# EAGLE design ForceReset (EAGLE 7.6.0)
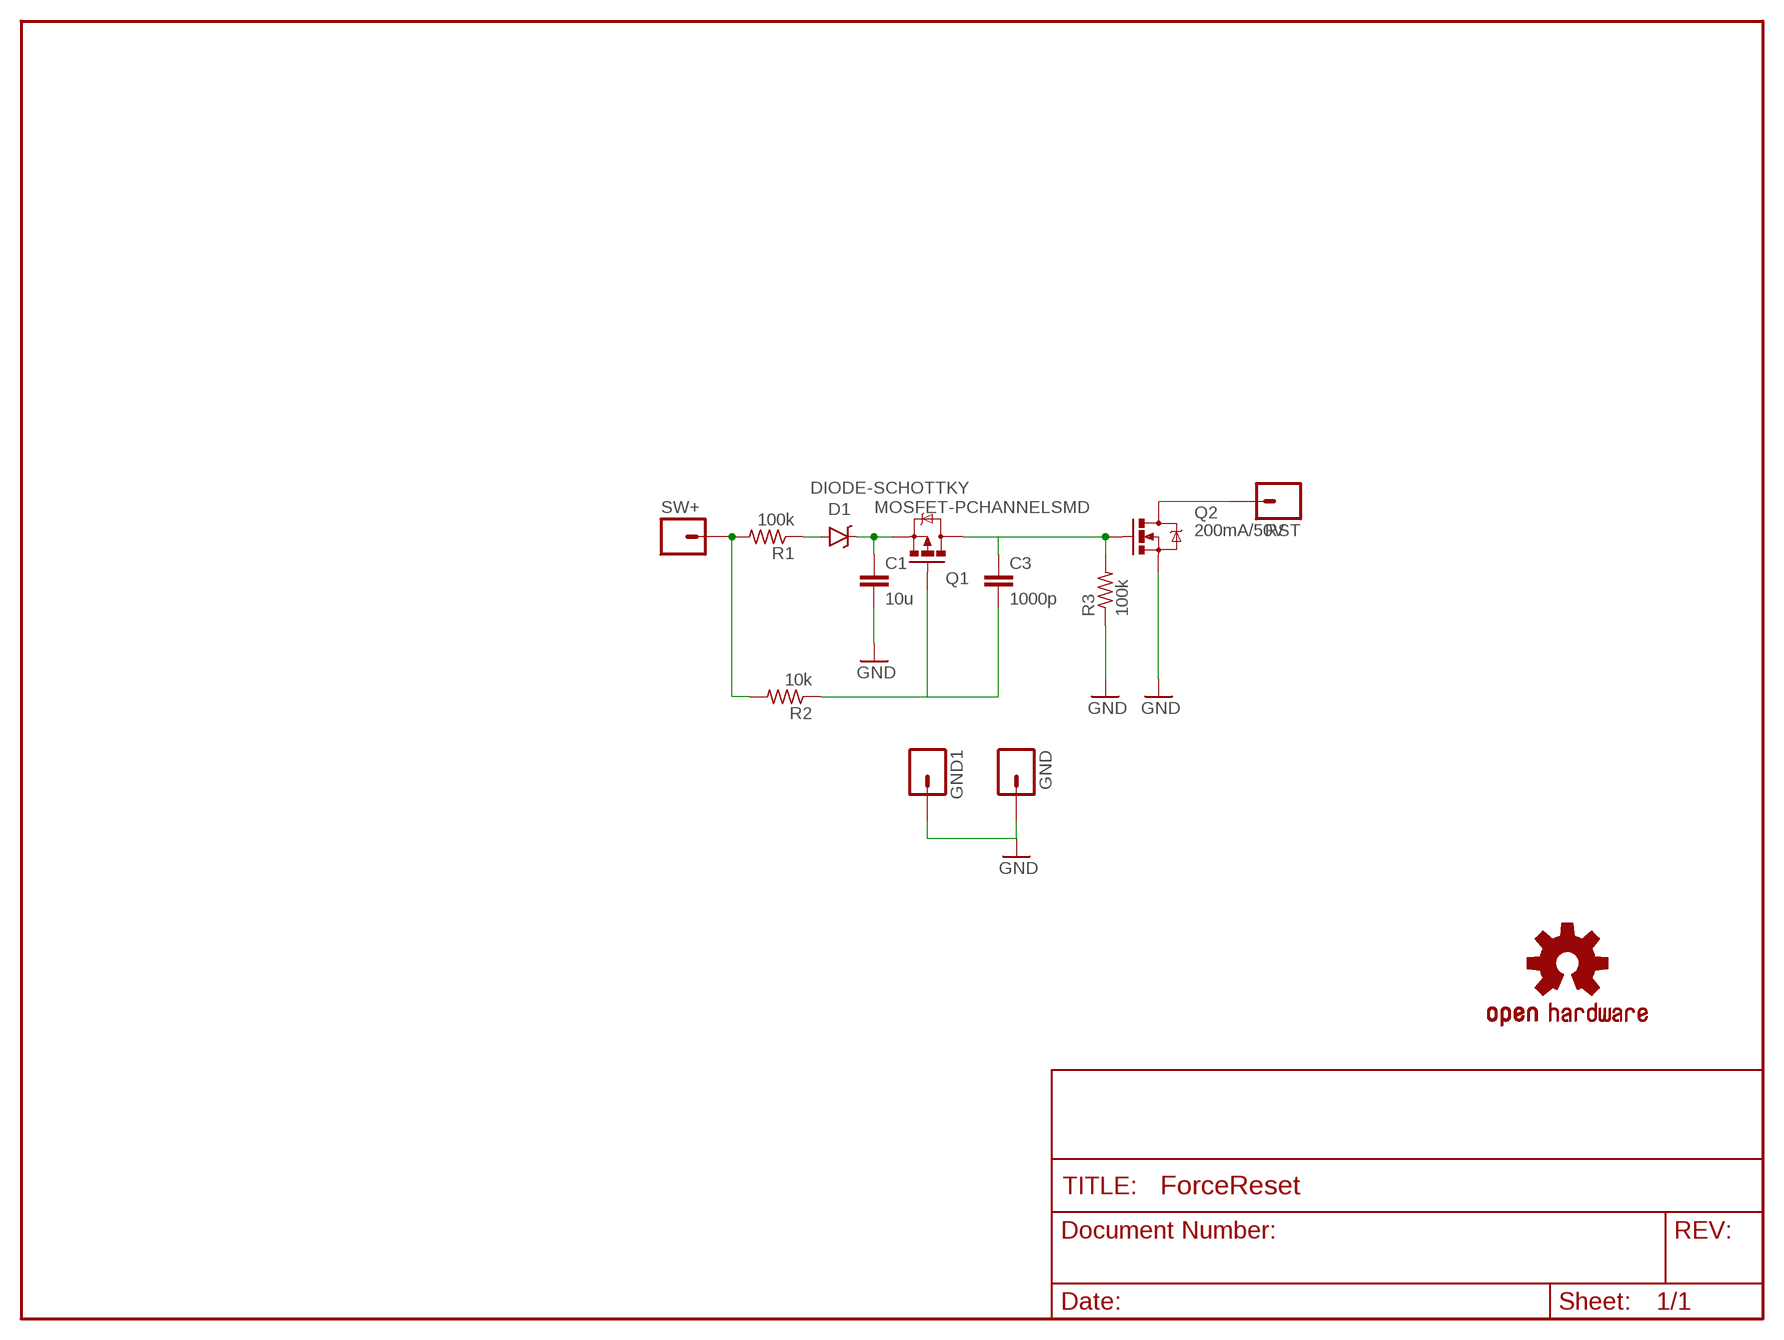
[diagram p0: schematic, sheet 1]

## Parts
C1  10u  CAP1608  [1608]
C3  1000p  CAP1608  [1608]
D1  DIODE-SCHOTTKY  [TUMD2]
GND  M01PTH  [1X01]
GND1  M01PTH  [1X01]
LOGO1  OSHW-LOGOS  [OSHW-LOGO-S]
Q1  MOSFET-PCHANNELSMD  [SOT23-3]
Q2  200mA/50V  MOSFET-NCHANNELBSS138  [SOT23-3]
R1  100k  R-US_1608  [1608]
R2  10k  R-US_1608  [1608]
R3  100k  R-US_1608  [1608]
RST  M01PTH  [1X01]
SW+  M01PTH  [1X01]

## Nets
GND: C1.P$2 GND1.1 GND.1 Q2.2(S) R3.P$1
N$1: R1.P$2 R2.P$2 SW+.1
N$2: C1.P$1 D1.C Q1.2(S)
N$3: C3.P$1 Q1.3(D) Q2.1(G) R3.P$2
N$4: Q2.3(D) RST.1
N$5: C3.P$2 Q1.1(G) R2.P$1
N$6: D1.A R1.P$1

## Library data of the parts
C1 C3 = KinyaLibrary:CAP: Capacitor Standard 0603 ceramic capacitor, and 0.1" leaded capacitor.
D1 = KinyaLibrary:DIODE-SCHOTTKY: Schottky diodes in SFE's production catalog BAT20J 1A 23V 0.62Vf RB751 120mA 40V 0.37Vf PMEG4005EJ 0.5A 40V 0.42Vf MBRA140 1A 40V 0.5Vf B340A 3A 40V SMA
GND GND1 RST SW+ = SparkFun-Connectors:M01: Header 1 Standard 1-pin 0.1" header. Use with straight break away headers (SKU : PRT-00116), right angle break away headers (PRT-00553), swiss pins (PRT-00743), machine pins (PRT-00117), and female headers (PRT-00115).
LOGO1 = SparkFun-Aesthetics:OSHW-LOGO: Open Source Hardware Logo This logo indicates the piece of hardware it is found on incorporates a OSHW license and/or adheres to the definition of open source hardware found here: http://freedomdefined.org/OSHW
Q1 = SparkFun-DiscreteSemi:MOSFET-PCHANNEL: Generic PMOSFET IRLML2244 - TRANS-11153 (SOT-23 -20V -4.3A) (1.Gate 2.Source 3.Drain) FQP27P06 - COM-10349 <http://www.sparkfun.com/products/10349> (TO-220 -60V -27A) (1.Gate 2.Source 3.Drain)
Q2 = SparkFun-DiscreteSemi:MOSFET-NCHANNEL: Common NMOSFET Parts MFG P/N Store ID Prod ID FDD8780 TRANS-09984 SI7820DN TRANS-11055 FDS6630A IC-08089 2N7002PW TRANS-11151 FQP30N06L COM-10213 TRANS-10060 BSS123LT1G TRANS-08345 BSS138 TRANS-00830 BS170 2N7000; PROD_ID: TRANS-00830
R1-R3 = KinyaLibrary:R-US_: RESISTOR, American symbol

## Board
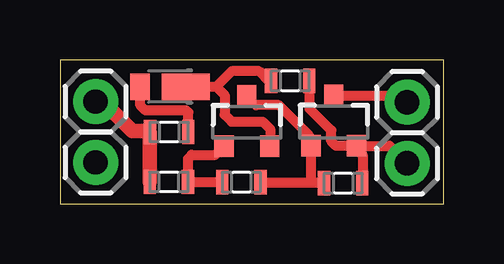
[diagram p1: board, top side]
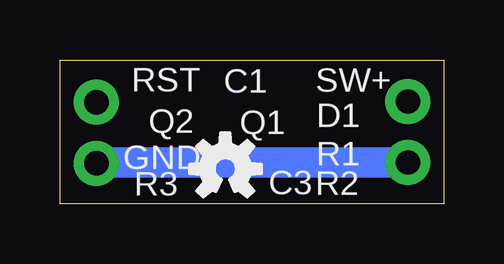
[diagram p2: board, bottom side, seen from below]

Size 15.98 x 6.02 mm. Coordinates in mm from the lower left corner, seen from the top.
Outline: 0,0 15.98,0 15.98,6.02 0,6.02 0,0
Copper layers (1*16): Top 0.035mm / dielectric 1.5mm / Bottom 0.035mm
Design rules "Elecrow_2-layer_eagle_rule": minimum track width 6mil, minimum drill 12mil, track to track 6mil, track to pad 6mil, pad to pad 6mil, via to via 6mil, smd to smd 0mil, copper to edge 10mil, drill to drill 10mil, minimum pad ring 10mil, minimum via ring 6mil, stop-mask expansion 2mil, vias tented up to drill 100mil, thermal gap 10mil

### Footprints (pad centres in the part's own frame; a part is rotated, then mirrored left to right if it is on the bottom)
1608 = smd 0.508 x 1.016: P$1 -0.8,0; P$2 0.8,0
TUMD2 = smd 0.8 x 1.1: A 1.25,0 | smd 2 x 1.1: C -0.65,0
1X01 = drill 1.016 pad 1.88: 1 0,0
SOT23-3 = smd 0.8 x 0.9: 1 -0.95,-1; 2 0.95,-1; 3 0,1.1

### Placement (x,y rotation side)
C1  9.59,5.14 0 top
C3  7.56,0.91 180 top
D1  4.58,4.9 180 top
GND  14.47,1.7 0 top
GND1  1.49,1.74 0 top
LOGO1  9.09,1.47 0 bottom
Q1  7.79,3.42 0 top
Q2  11.4,3.43 0 top
R1  4.55,3.01 180 top
R2  4.53,0.93 180 top
R3  11.8,0.88 180 top
RST  14.47,4.25 0 top
SW+  1.49,4.28 0 top

### Tracks (layer width: path | path; a pad name or v marks a point on that pad's centre or on a via)
GND
  Top 0.254: Q2.2 12.36,2.31 | 12.61,0.89 R3.P$1 | C1.P$2
  Top 0.406: 12.36,2.31 12.61,2.06 12.61,0.89 | C1.P$2 10.4,3.98 11.3,3.07 11.3,2.62 11.49,2.43 Q2.2 13.74,2.43 GND.1
  Bottom 1.27: GND1.1 14.43,1.74 GND.1
N$1
  Top 0.254: 3.7,3.06 R1.P$2 3.73,3
  Top 0.61: SW+.1 1.79,4.28 3.01,3.06 3.7,3.06 | R2.P$2 3.73,3
N$2
  Top 0.254: 8.75,2.43 Q1.2 | C1.P$1 8.7,5.14
  Top 0.406: D1.C 6.5,4.9 | 6.5,4.9 6.86,4.55 6.86,3.73 7.15,3.44 8.45,3.44 8.75,3.14 8.75,2.43 | 8.7,5.14 8.29,5.55 7.15,5.55 6.5,4.9
N$3
  Top 0.254: 10.96,0.91 R3.P$2 | 10.46,0.95 10.49,0.91 | 8.17,4.13 Q1.3
  Top 0.406: C3.P$1 10.49,0.91 10.96,0.91 | 10.46,0.95 Q2.1 10.38,2.85 9.12,4.13 8.17,4.13
N$4
  Top 0.406: Q2.3 14.19,4.53 RST.1
N$5
  Top 0.305: 6.74,0.93 C3.P$2
  Top 0.406: Q1.1 6.48,2.06 5.49,2.06 5.33,1.91 R2.P$1 6.74,0.93
N$6
  Top 0.305: 3.35,4.88 D1.A
  Top 0.406: R1.P$1 5.35,3.82 5.26,3.91 3.56,3.91 3.35,4.12 3.35,4.88